# EasyEDA Pro project ProPrj_RGB Controller_2025-11-02.epro

# Schematic Flare Schematic
Board Name: Flare; Create Date: 2025-03-25; Page Name: P1; Project Name: RGB Controller; Schematic Name: Flare Schematic; Update Date: 2025-04-02; Company: folflabs.com; Page Size: A4; Version: V1.0
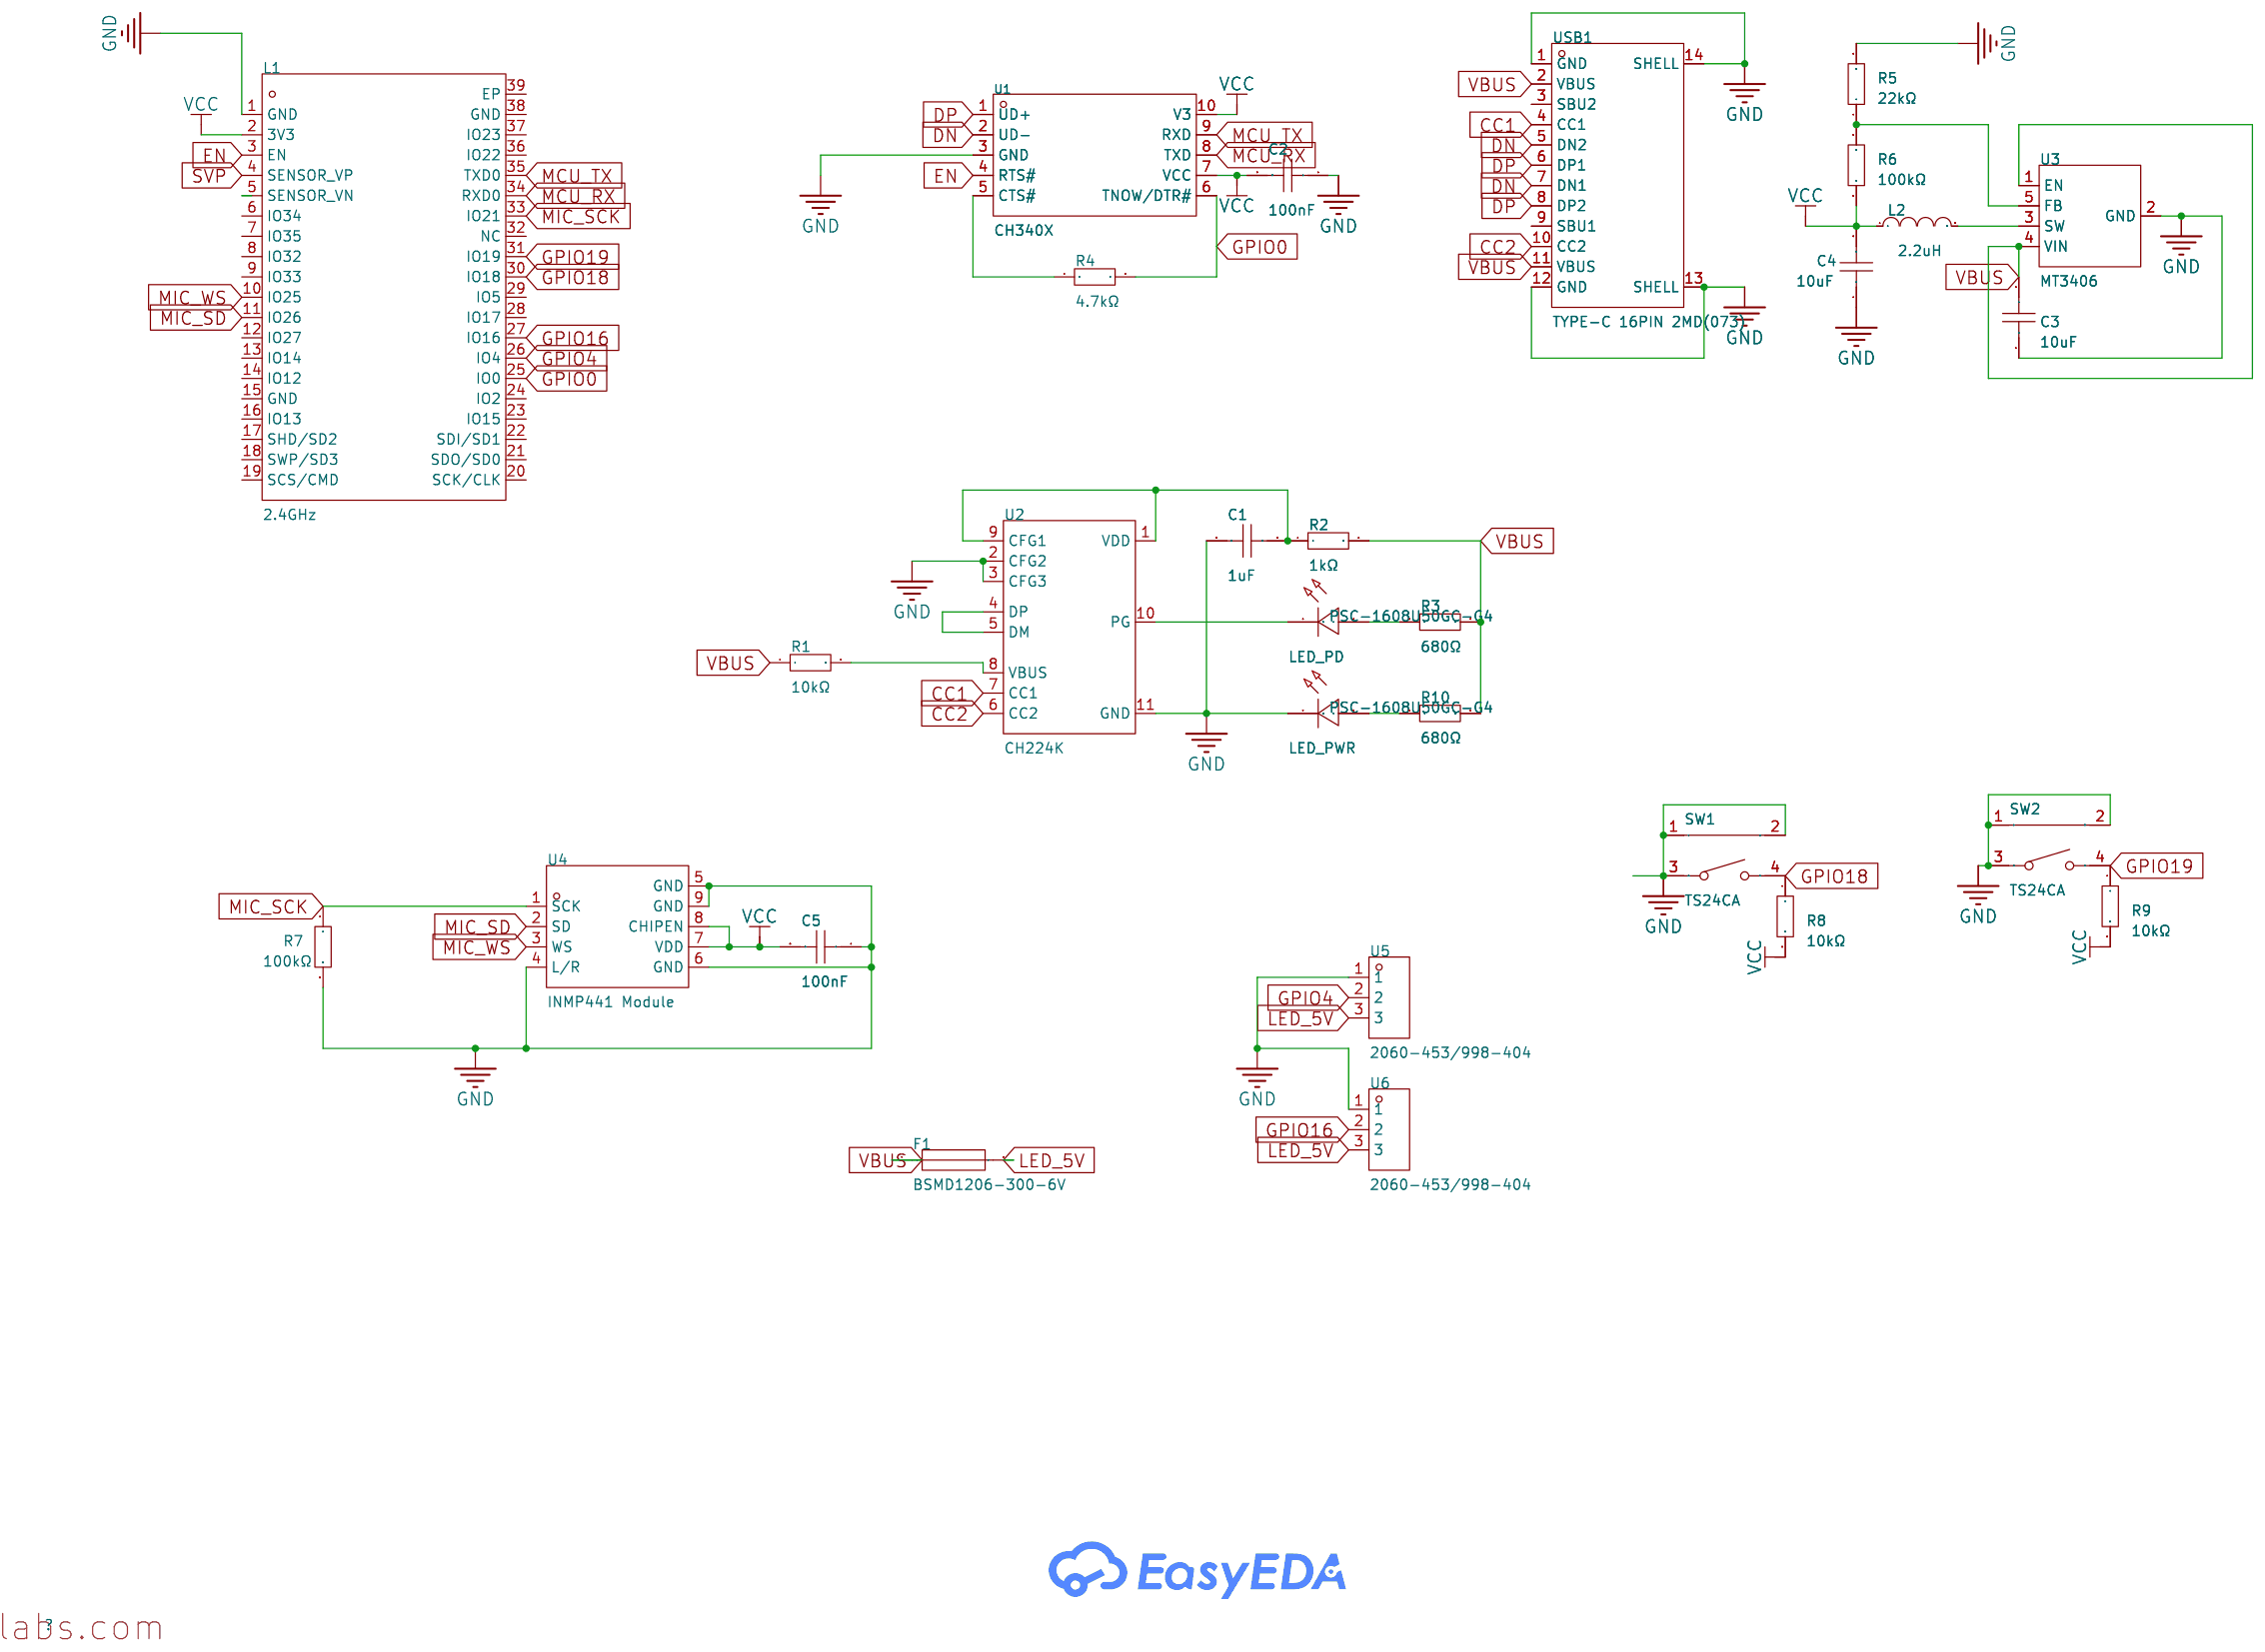
[diagram p0: schematic sheet]

## Parts
C1  1uF  [C0402]
C2  100nF  [C0402]
C3  10uF  [C0603]
C4  10uF  [C0603]
C5  100nF  [C0402]
F1  BSMD1206-300-6V  [F1206]
L1  2.4GHz  [WIFIM-SMD_ESP32-S32MB]
L2  2.2uH  [IND-SMD_L2.5-W2.0_MHCHL2520]
LED_PD  PSC-1608U50GC-G4  [LED0603-RD_GREEN]
LED_PWR  PSC-1608U50GC-G4  [LED0603-RD_GREEN]
R1  10kΩ  [R0402]
R2  1kΩ  [R0402]
R3  680Ω  [R0402]
R4  4.7kΩ  [R0402]
R5  22kΩ  [R0402]
R6  100kΩ  [R0402]
R7  100kΩ  [R0402]
R8  10kΩ  [R0402]
R9  10kΩ  [R0402]
R10  680Ω  [R0402]
SW1  TS24CA  [SW-SMD_TS24CA]
SW2  TS24CA  [SW-SMD_TS24CA]
U1  CH340X  [MSOP-10_L3.0-W3.0-P0.50-LS5.0-BL]
U2  CH224K  [ESSOP-10_L4.9-W3.9-P1.0-LS6.0-TL-EP]
U3  MT3406  [SOT-23-5_L2.9-W1.6-P0.95-LS2.8-BR]
U4  INMP441 Module  [MID-SMD_L4.7-W3.8_INMP441ACEZ]
U5  2060-453/998-404  [CONN-SMD_2060-453]
U6  2060-453/998-404  [CONN-SMD_2060-453]
USB1  TYPE-C 16PIN 2MD(073)  [USB-C-SMD_TYPE-C-6PIN-2MD-073]

## Library data of the parts
C1 = CL05A105KO5NNNC: Capacitance: Tolerance:±10% Tolerance:±10% Voltage Rated: Temperature Coefficient:; LCSC Part Name: 1uF ±10% 16V; Supplier Part: C29266; Manufacturer: SAMSUNG(三星); Supplier Footprint: 0402; JLCPCB Part Class: Extended Part; Datasheet: https://atta.szlcsc.com/upload/public/pdf/source/20160218/1457707763339.pdf; Supplier: LCSC; Tolerance: ±10%
C2 C5 = CL05B104KO5NNNC: Capacitance: Tolerance:±10% Tolerance:±10% Voltage Rated: Temperature Coefficient:; LCSC Part Name: 100nF ±10% 16V; Supplier Part: C1525; Manufacturer: SAMSUNG(三星); Supplier Footprint: 0402; JLCPCB Part Class: Basic Part; Datasheet: https://atta.szlcsc.com/upload/public/pdf/source/20160218/1457707763339.pdf; Supplier: LCSC; Tolerance: ±10%
C3 C4 = CL10A106KP8NNNC: Capacitance: Tolerance:±10% Tolerance:±10% Voltage Rated: Temperature Coefficient:; LCSC Part Name: 10uF ±10% 10V; Supplier Part: C19702; Manufacturer: SAMSUNG(三星); Supplier Footprint: 0603; JLCPCB Part Class: Basic Part; Datasheet: https://atta.szlcsc.com/upload/public/pdf/source/20160218/1457707763339.pdf; Supplier: LCSC; Tolerance: ±10%
F1 = BSMD1206-300-6V: Voltage - Max:6V Current - Max:100A Hold Current:3A Trip Current:6A Power Dissipation:1W Resistance - Initial (Ri) (Min):10mΩ Resistance - Post Trip (R1) (Max):50mΩ Time to Trip(Max):4s Operating Temperature:-40℃~+85℃ Operating Temperature:-40℃~+85℃; LCSC Part Name: 6V 3A 1206自恢复; Supplier Part: C883136; Manufacturer: BHFUSE(佰宏); Supplier Footprint: 1206; JLCPCB Part Class: Extended Part; Datasheet: https://atta.szlcsc.com/upload/public/pdf/source/20250212/FB96FB30E33193B14368CE94976BC83E.pdf; Supplier: LCSC; Voltage - Max: 6V; Current - Max: 100A; Hold Current: 3A; Trip Current: 6A; Power Dissipation: 1W; Resistance - Initial (Ri) (Min): 10mΩ; Resistance - Post Trip (R1) (Max): 50mΩ; Time to Trip(Max): 4s; Operating Temperature: -40℃~+85℃
L1 = ESP32-S32Mb: Core Processor:ESP32芯片 Wireless Standard:- Support Interface:I2C；IR；UART；DAC；SPI；PWM；SDIO；ADC；I2S Frequency:2.4GHz Antenna Type:板载PCBAntenna Output Power:17dBm Output Power:17dBm Operating Voltage:3.3V Operating Voltage:3.3V Receive  Current:- Send  Curre; LCSC Part Name: WiFi模块 ESP32-S 32Mbit; Supplier Part: C2764096; Manufacturer: Ai-Thinker(安信可); JLCPCB Part Class: Extended Part; Datasheet: https://atta.szlcsc.com/upload/public/pdf/source/20210401/C2764096_2F6DB23B9416428872DCC3F2F513F525.pdf; Supplier: LCSC; Core Processor: ESP32芯片; Support Interface: I2C；IR；UART；DAC；SPI；PWM；SDIO；ADC；I2S; Antenna Type: 板载PCBAntenna; Output Power: 17dBm; Operating Voltage: 3.3V; Sensitivity: -90dBm; Operating Temperature: -20℃~+85℃
L2 = FTC252012S2R2MBCA: Inductance: Tolerance:±20% Tolerance:±20% Rated Current:3A Saturation Current (Isat):3.8A DC Resistance (DCR): Type:一体成型电感; LCSC Part Name: 2.2uH ±20% 3.8A; Supplier Part: C5832372; Manufacturer: cjiang(长江微电); Supplier Footprint: 1008; JLCPCB Part Class: Extended Part; Datasheet: https://atta.szlcsc.com/upload/public/pdf/source/20230602/8FFEDA9C0247A92A0D4B67554BFE4091.pdf; Supplier: LCSC; Tolerance: ±20%; Rated Current: 3A; Saturation Current (Isat): 3.8A; Type: 一体成型电感
LED_PD LED_PWR = PSC-1608U50GC-G4: Emitted Color:Green; LCSC Part Name: 钻孔1608高亮绿灯; Supplier Part: C22371298; Manufacturer: HONGLITRONIC(鸿利光电); Supplier Footprint: 0603; JLCPCB Part Class: Extended Part; Datasheet: https://atta.szlcsc.com/upload/public/pdf/source/20240328/1E8DD16A94D1B62ECE930CA637B2D3DA.pdf; Supplier: LCSC; Emitted Color: Green
R1 R8 R9 = 0402WGF1002TCE: Type:Thick Film Resistors Resistance:10kΩ Tolerance:±1% Tolerance:±1% Power(Watts): Overload Voltage (Max): Temperature Coefficient:±100ppm/℃ Temperature Coefficient:±100ppm/℃ Operating Temperature Range:-55℃~+155℃ Operating Temperature Range:-55℃~+155℃; LCSC Part Name: 10kΩ ±1% 62.5mW 厚膜电阻; Supplier Part: C25744; Manufacturer: UNI-ROYAL(厚声); Supplier Footprint: 0402; JLCPCB Part Class: Basic Part; Datasheet: https://atta.szlcsc.com/upload/public/pdf/source/20200306/C422600_1E6D84923E4A46A82E41ADD87F860B5C.pdf; Supplier: LCSC; Type: Thick Film Resistors; Tolerance: ±1%; Temperature Coefficient: ±100ppm/℃; Operating Temperature Range: -55℃~+155℃
R2 = 0402WGF1001TCE: Type:Thick Film Resistors Resistance:1kΩ Tolerance:±1% Tolerance:±1% Power(Watts): Overload Voltage (Max): Temperature Coefficient:±100ppm/℃ Temperature Coefficient:±100ppm/℃ Operating Temperature Range:-55℃~+155℃ Operating Temperature Range:-55℃~+155℃; LCSC Part Name: 1kΩ ±1% 62.5mW 厚膜电阻; Supplier Part: C11702; Manufacturer: UNI-ROYAL(厚声); Supplier Footprint: 0402; JLCPCB Part Class: Basic Part; Datasheet: https://atta.szlcsc.com/upload/public/pdf/source/20200306/C422600_1E6D84923E4A46A82E41ADD87F860B5C.pdf; Supplier: LCSC; Type: Thick Film Resistors; Tolerance: ±1%; Temperature Coefficient: ±100ppm/℃; Operating Temperature Range: -55℃~+155℃
R3 R10 = 0402WGF6800TCE: Type:Thick Film Resistors Resistance: Tolerance:±1% Tolerance:±1% Power(Watts): Overload Voltage (Max): Temperature Coefficient:±100ppm/℃ Temperature Coefficient:±100ppm/℃ Operating Temperature Range:-55℃~+155℃ Operating Temperature Range:-55℃~+155℃; LCSC Part Name: 680Ω ±1% 62.5mW 厚膜电阻; Supplier Part: C25130; Manufacturer: UNI-ROYAL(厚声); Supplier Footprint: 0402; JLCPCB Part Class: Extended Part; Datasheet: https://atta.szlcsc.com/upload/public/pdf/source/20200306/C422600_1E6D84923E4A46A82E41ADD87F860B5C.pdf; Supplier: LCSC; Type: Thick Film Resistors; Tolerance: ±1%; Temperature Coefficient: ±100ppm/℃; Operating Temperature Range: -55℃~+155℃
R4 = 0402WGF4701TCE: Type:Thick Film Resistors Resistance:4.7kΩ Tolerance:±1% Tolerance:±1% Power(Watts): Overload Voltage (Max): Temperature Coefficient:±100ppm/℃ Temperature Coefficient:±100ppm/℃ Operating Temperature Range:-55℃~+155℃ Operating Temperature Range:-55℃~+155℃; LCSC Part Name: 4.7kΩ ±1% 62.5mW 厚膜电阻; Supplier Part: C25900; Manufacturer: UNI-ROYAL(厚声); Supplier Footprint: 0402; JLCPCB Part Class: Basic Part; Datasheet: https://atta.szlcsc.com/upload/public/pdf/source/20200306/C422600_1E6D84923E4A46A82E41ADD87F860B5C.pdf; Supplier: LCSC; Type: Thick Film Resistors; Tolerance: ±1%; Temperature Coefficient: ±100ppm/℃; Operating Temperature Range: -55℃~+155℃
R5 = 0402WGF2202TCE: Type:Thick Film Resistors Resistance:22kΩ Tolerance:±1% Tolerance:±1% Power(Watts): Overload Voltage (Max): Temperature Coefficient:±100ppm/℃ Temperature Coefficient:±100ppm/℃ Operating Temperature Range:-55℃~+155℃ Operating Temperature Range:-55℃~+155℃; LCSC Part Name: 22kΩ ±1% 62.5mW 厚膜电阻; Supplier Part: C25768; Manufacturer: UNI-ROYAL(厚声); Supplier Footprint: 0402; JLCPCB Part Class: Basic Part; Datasheet: https://atta.szlcsc.com/upload/public/pdf/source/20200306/C422600_1E6D84923E4A46A82E41ADD87F860B5C.pdf; Supplier: LCSC; Type: Thick Film Resistors; Tolerance: ±1%; Temperature Coefficient: ±100ppm/℃; Operating Temperature Range: -55℃~+155℃
R6 R7 = 0402WGF1003TCE: Type:Thick Film Resistors Resistance:100kΩ Tolerance:±1% Tolerance:±1% Power(Watts): Overload Voltage (Max): Temperature Coefficient:±100ppm/℃ Temperature Coefficient:±100ppm/℃ Operating Temperature Range:-55℃~+155℃ Operating Temperature Range:-55℃~+155℃; LCSC Part Name: 100kΩ ±1% 62.5mW 厚膜电阻; Supplier Part: C25741; Manufacturer: UNI-ROYAL(厚声); Supplier Footprint: 0402; JLCPCB Part Class: Basic Part; Datasheet: https://atta.szlcsc.com/upload/public/pdf/source/20200306/C422600_1E6D84923E4A46A82E41ADD87F860B5C.pdf; Supplier: LCSC; Type: Thick Film Resistors; Tolerance: ±1%; Temperature Coefficient: ±100ppm/℃; Operating Temperature Range: -55℃~+155℃
SW1 SW2 = TS24CA: Circuit:SPST Actuator Style:Rectangle button Mounting Style:卧贴 Switch Length:4.55mm Switch Width:1.8mm Switch Height:3.5mm Contact Current:50mA Voltage Rating (DC):12V With Lamp:- Mechanical Life:-; LCSC Part Name: 4.55*1.8*3.5mm 卧贴 轻触开关; Supplier Part: C393942; Manufacturer: SHOU HAN(首韩); Supplier Footprint: SMD; Datasheet: https://atta.szlcsc.com/upload/public/pdf/source/20190521/C393942_591A9E318887EFA4274D34029981AD99.pdf; Supplier: LCSC; Circuit: SPST; Actuator Style: Rectangle button; Mounting Style: 卧贴; Switch Length: 4.55mm; Switch Width: 1.8mm; Switch Height: 3.5mm; Contact Current: 50mA; Voltage Rating (DC): 12V
U1 = CH340X: Supplier Part: C3035748; Manufacturer: WCH(南京沁恒); Supplier Footprint: MSOP-10; JLCPCB Part Class: Extended Part; Datasheet: https://atta.szlcsc.com/upload/public/pdf/source/20230530/6E401E9554E9F5311886CC8B3F89B62E.pdf; Supplier: LCSC
U2 = CH224K: LCSC Part Name: USBPD等多快充协议受电芯片CH224; Supplier Part: C970725; Manufacturer: WCH(南京沁恒); Supplier Footprint: ESSOP-10-150mil-1mm; JLCPCB Part Class: Extended Part; Datasheet: https://atta.szlcsc.com/upload/public/pdf/source/20240313/43C2AFDDBDD1F65B60386D2CCAB0811B.pdf; Supplier: LCSC
U3 = MT3406: Function:Step-down type Output Type:Adjustable Voltage - Supply:2V~6V Voltage - Supply:2V~6V Output Voltage:600mV~6V Output Voltage:600mV~6V Output Current:1A Frequency - Switching:1.5MHz Frequency - Switching:1.5MHz Operating Temperature:-40℃~+85℃ Operat; LCSC Part Name: 1A，2V-6V输入，1.5MHz同步降压转换器; Supplier Part: C22462728; Manufacturer: 西安航天民芯; Supplier Footprint: SOT-23-5; JLCPCB Part Class: Extended Part; Datasheet: https://atta.szlcsc.com/upload/public/pdf/source/20240607/11CF4F05DFC4AC07D3B1C3A6F13BBD74.pdf; Supplier: LCSC; Function: Step-down type; Output Type: Adjustable; Voltage - Supply: 2V~6V; Output Voltage: 600mV~6V; Output Current: 1A; Frequency - Switching: 1.5MHz; Operating Temperature: -40℃~+85℃; Synchronous Rectifier: Yes; Number of Outputs: 1; Topology: Step-down; Quiescent Current: 10uA; Switch tube (built-in/external): Built-in
U4 = INMP441 Module: Supplier Part: C9900169261; Supplier Footprint: LGA-9; JLCPCB Part Class: Extended Part; Supplier: LCSC
U5 U6 = 2060-453/998-404: Structure:1x3P Pitch:4mm Color:White Mounting Style:- Number of Pins:3P Number of PINs Per Row:3 Number of Rows:1 Current Rating (Max):9A Voltage Rating (Max):320V Wire Gauge - AWG:18~24 Wire Gauge - mm2:- Operating Temperature Range:-60℃~+105℃ Operating; LCSC Part Name: 1x3P 4mm 每排P数:3 排数:1; Supplier Part: C2765056; Manufacturer: WAGO(万可); Supplier Footprint: SMD,P=4mm; JLCPCB Part Class: Extended Part; Datasheet: https://atta.szlcsc.com/upload/public/pdf/source/20210406/C2765056_9CDA2223E0E8215FA599894D0B3F06B8.pdf; Supplier: LCSC; Structure: 1x3P; Pitch: 4mm; Color: White; Number of Pins: 3P; Number of PINs Per Row: 3; Number of Rows: 1; Current Rating (Max): 9A; Voltage Rating (Max): 320V; Wire Gauge - AWG: 18~24; Operating Temperature Range: -60℃~+105℃
USB1 = TYPE-C 16PIN 2MD(073): Connector Type:Type-C Standard:USB 3.1 Gender:Female Mounting Style:Horizontal attachment Number of Contacts:16P Number of Ports:1 Current Rating - Power (Max):5A Operating Temperature Range:-25℃~+85℃ Operating Temperature Range:-25℃~+85℃ Rated Voltage (M; LCSC Part Name: Type-C 母 卧贴; Supplier Part: C2765186; Manufacturer: SHOU HAN(首韩); Supplier Footprint: SMD; Datasheet: https://atta.szlcsc.com/upload/public/pdf/source/20211123/39B17C16241EAC15C5E277BDA434118E.pdf; Supplier: LCSC; Connector Type: Type-C; Standard: USB 3.1; Gender: Female; Mounting Style: Horizontal attachment; Number of Contacts: 16P; Number of Ports: 1; Current Rating - Power (Max): 5A; Operating Temperature Range: -25℃~+85℃; Rated Voltage (Max): 5V; Connect-Disconnect Life: 5000 Cuts; Core Colour: Black

## Nets
GND: C1.2 C2.1 C3.1 C4.1 C5.1 L1.1(GND) LED_PWR.1(C) R5.2 R7.2 SW1.1 SW1.2 SW1.3 SW2.1 SW2.2 SW2.3 U1.3(GND) U2.2(CFG2) U2.3(CFG3) U2.11(GND) U3.2(GND) U4.4(L/R) U4.5(GND) U4.6(GND) U4.9(GND) U5.1 U6.1 USB1.1(GND) USB1.12(GND) USB1.13(SHELL) USB1.14(SHELL)
VBUS: C3.2 F1.1 R1.1 R2.2 R3.2 R10.2 U3.1(EN) U3.4(VIN) USB1.2(VBUS) USB1.11(VBUS)
VCC: C2.2 C4.2 C5.2 L1.2(3V3) L2.1 R6.2 R8.2 R9.2 U1.7(VCC) U1.10(V3) U4.7(VDD) U4.8(CHIPEN)
CC1: U2.7(CC1) USB1.4(CC1)
CC2: U2.6(CC2) USB1.10(CC2)
DN: U1.2(UD-) USB1.5(DN2) USB1.7(DN1)
DP: U1.1(UD+) USB1.6(DP1) USB1.8(DP2)
EN: L1.3(EN) U1.4(RTS#)
GPIO0: L1.25(IO0) R4.2 U1.6(TNOW/DTR#)
GPIO4: L1.26(IO4) U5.2
GPIO16: L1.27(IO16) U6.2
GPIO18: L1.30(IO18) R8.1 SW1.4
GPIO19: L1.31(IO19) R9.1 SW2.4
LED_5V: F1.2 U5.3 U6.3
MCU_RX: L1.34(RXD0) U1.8(TXD)
MCU_TX: L1.35(TXD0) U1.9(RXD)
MIC_SCK: L1.33(IO21) R7.1 U4.1(SCK)
MIC_SD: L1.11(IO26) U4.2(SD)
MIC_WS: L1.10(IO25) U4.3(WS)
SVP: L1.4(SENSOR_VP)
$1N2065: LED_PD.2(A) R3.1
$1N2819: R5.1 R6.1 U3.5(FB)
$1N5758: LED_PWR.2(A) R10.1
Net-(C1-1): C1.1 R2.1 U2.1(VDD) U2.9(CFG1)
Net-(L2-2): L2.2 U3.3(SW)
Net-(LED_PD-1): LED_PD.1(C) U2.10(PG)
Net-(R1-2): R1.2 U2.8(VBUS)
Net-(R4-1): R4.1 U1.5(CTS#)
Net-(U2-4): U2.4(DP) U2.5(DM)

Not connected (* = marked no-connect by the designer): L1 5(SENSOR_VN) 6(IO34) 7(IO35) 8(IO32) 9(IO33) 12(IO27) 13(IO14) 14(IO12) 15(GND) 16(IO13) 17(SHD/SD2) 18(SWP/SD3) 19(SCS/CMD) 20(SCK/CLK) 21(SDO/SD0) 22(SDI/SD1) 23(IO15) 24(IO2) 28(IO17) 29(IO5) 32(NC) 36(IO22) 37(IO23) 38(GND) 39(EP); USB1 3(SBU2) 9(SBU1)

# Board Flare PCB
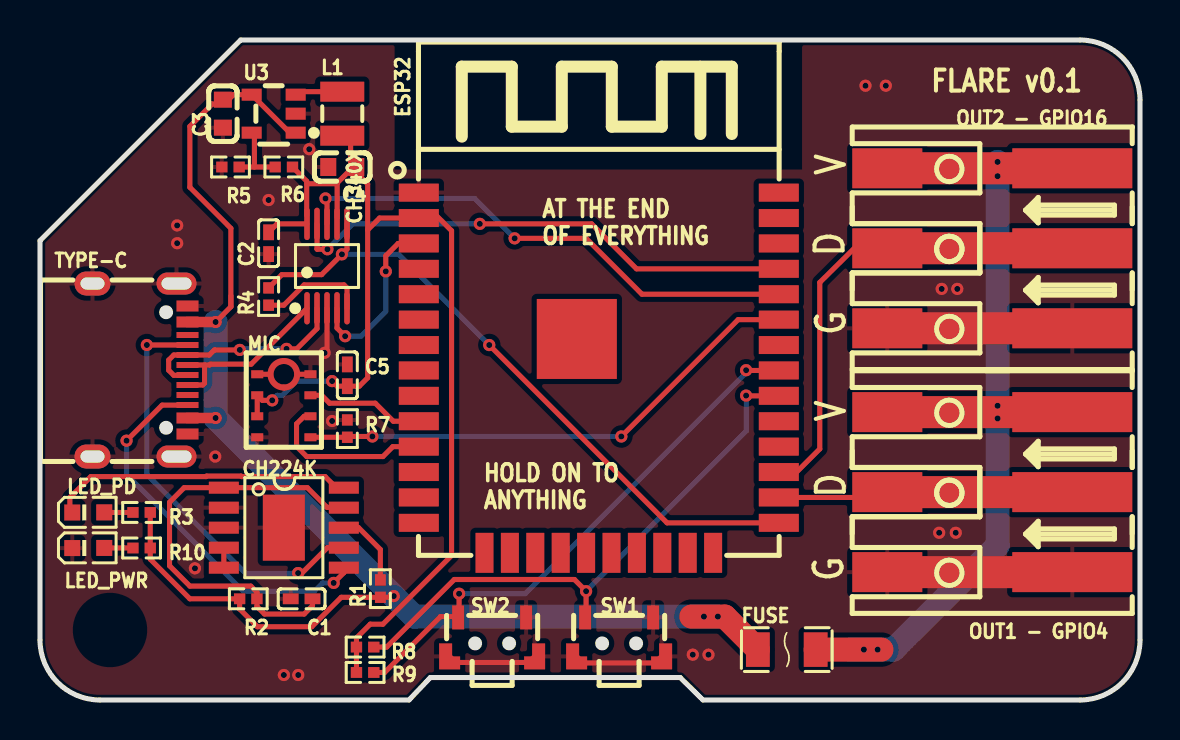
[diagram p1: board, top side]
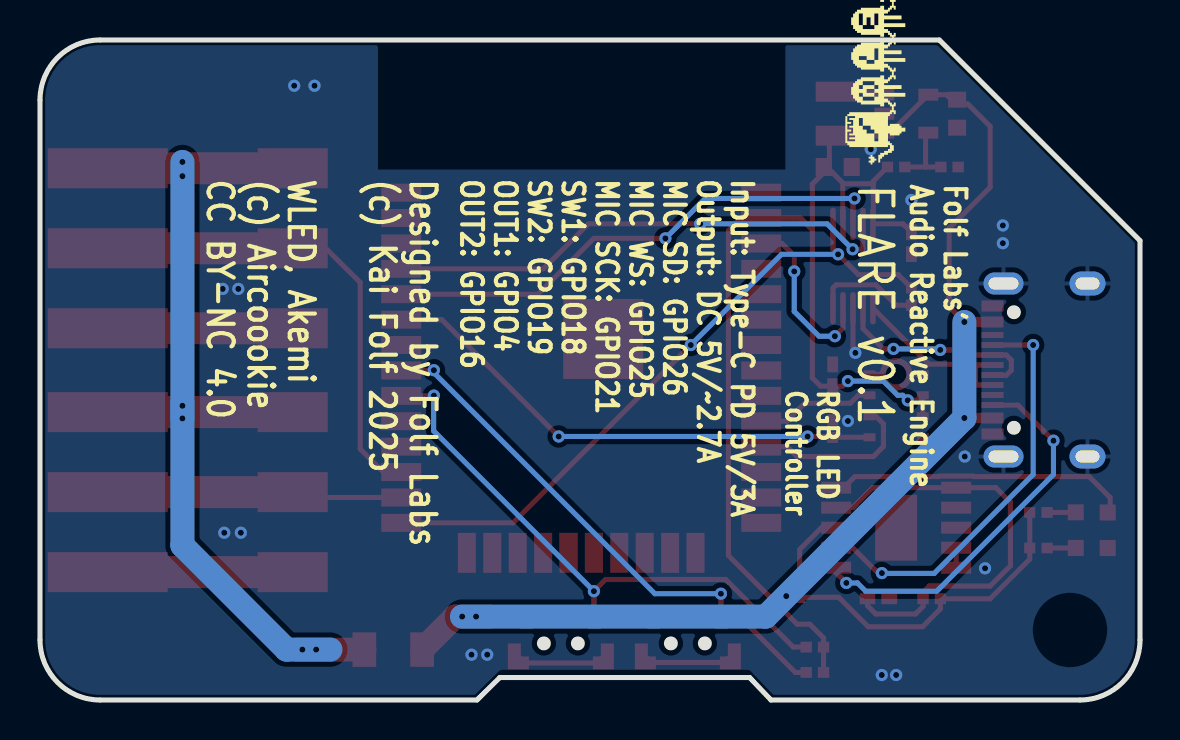
[diagram p2: board, bottom side, seen from below]

Outline 55 x 33 mm; copper layers: Top Layer, Bottom Layer. Coordinates in mm from the lower left corner of the outline.
Outline path: 0,22.97 0,3 arc(0.88,0.88) 3,0 18.45,0 19.52,1.12 32.01,1.12 33.15,0 52,0 arc(54.12,0.88) 55,3 55,30 arc(54.12,32.12) 52,33 10.03,33 0,22.97
Stack: Top Layer 0.035mm / Dielectric1 1.51mm FR4 er 4.5 / Bottom Layer 0.035mm

## Design rules (mm)
template: Custom Config
spacing copperThickness1oz (default): track to track 0.102, other pairs 0.152 to 0.3
spacing copperThickness2oz: track to track 0.203, other pairs 0.152 to 0.3
track width copperThickness1oz (default): min 0.127, default 0.254, max 2.54
track width copperThickness2oz: min 0.203, default 0.254, max 2.54
differential pair differentialPair (default): width min 0.127, default 0.254, max 2.54; gap min 0.152, default 0.152
via viaSize (default): diameter min 0.5, default 0.61, max 10; hole min 0.3, default 0.305, max 6.3

## Placement (name value [footprint] x y rotation side)
C1  1uF  [C0402]  13.08 5.06 180 top
C2  100nF  [C0402]  11.43 22.84 90 top
C3  10uF  [C0603]  9.14 29.32 90 top
C4  10uF  [C0603]  15.11 26.65 0 top
C5  100nF  [C0402]  15.37 16.24 270 top
CH224K  CH224K  [ESSOP-10_L4.9-W3.9-P1.0-LS6.0-TL-EP]  12.19 8.62 270 top
CH340X  CH340X  [MSOP-10_L3.0-W3.0-P0.50-LS5.0-BL]  14.35 21.7 0 top
ESP32  2.4GHz  [WIFIM-SMD_ESP32-S32MB]  27.94 16.36 0 top
FUSE  BSMD1206-300-6V  [F1206]  37.34 2.52 0 top
L1  2.4GHz  [IND-SMD_L2.5-W2.0_MHCHL2520]  15.11 29.32 90 top
LED_PD  PSC-1608U50GC-G4  [LED0603-RD_GREEN]  2.41 9.38 0 top
LED_PWR  PSC-1608U50GC-G4  [LED0603-RD_GREEN]  2.41 7.6 0 top
MIC  INMP441 Module  [MID-SMD_L4.7-W3.8_INMP441ACEZ]  12.19 14.71 90 top
OUT1 - GPIO4  2060-453/998-404  [CONN-SMD_2060-453]  46.99 10.39 180 top
OUT2 - GPIO16  2060-453/998-404  [CONN-SMD_2060-453]  46.99 22.59 180 top
R1  10kΩ  [R0402]  17.02 5.57 90 top
R2  1kΩ  [R0402]  10.41 5.06 180 top
R3  680Ω  [R0402]  5.08 9.38 0 top
R4  4.7kΩ  [R0402]  11.43 20.17 90 top
R5  22kΩ  [R0402]  9.53 26.65 180 top
R6  100kΩ  [R0402]  12.19 26.65 0 top
R7  100kΩ  [R0402]  15.37 13.57 90 top
R8  10kΩ  [R0402]  16.26 2.65 180 top
R9  10kΩ  [R0402]  16.26 1.38 180 top
R10  680Ω  [R0402]  5.08 7.6 0 top
SW1  TS24CA  [SW-SMD_TS24CA]  28.96 3.16 180 top
SW2  TS24CA  [SW-SMD_TS24CA]  22.61 3.16 180 top
TYPE-C  TYPE-C 16PIN 2MD(073)  [USB-C-SMD_TYPE-C-6PIN-2MD-073]  5 16.5 270 top
U3  MT3406  [SOT-23-5_L2.9-W1.6-P0.95-LS2.8-BR]  11.68 29.32 0 top

## Footprints (pads in the part's own frame, mm; a bottom-side part is the same pattern mirrored in y, then rotated)
C0402
  rect 0.79x0.54 smd: 1(-0.545,0) 2(0.545,0)
C0603
  rect 0.8x0.9 smd: 1(-0.7,0) 2(0.7,0)
CONN-SMD_2060-453
  rect 6x2 smd: 1(-4.625,4) 2(-4.625,0) 3(-4.625,-4)
  rect 3.5x2 smd: 1(4.625,4) 2(4.625,0) 3(4.625,-4)
ESSOP-10_L4.9-W3.9-P1.0-LS6.0-TL-EP
  rect 0.6x1.5 smd: 1(-2,-3) 2(-1,-3) 3(0,-3) 4(1,-3) 5(2,-3) 6(2,3) 7(1,3) 8(0,3) 9(-1,3) 10(-2,3)
  rect 3.3x2.1 smd: 11(0,0)
F1206
  rect 1.19x1.728 smd: 1(-1.445,0) 2(1.445,0)
IND-SMD_L2.5-W2.0_MHCHL2520
  rect 1x2.2 smd: 1(-1.1,0) 2(1.1,0)
LED0603-RD_GREEN
  rect 0.8x0.8 smd: 1(-0.799,-0.004) 2(0.799,0.004)
MID-SMD_L4.7-W3.8_INMP441ACEZ
  rect 0.4x0.6 smd: 1(-1.575,-1.33) 2(-0.525,-1.33) 3(0.525,-1.33) 4(1.575,-1.33) 6(1.575,1.33) 7(0.525,1.33) 8(-0.525,1.33) 9(-1.575,1.33)
  custom 1.626x0.963 smd: 5(1.575,0.664)
  custom 1.626x0.966 smd: 5(1.575,-0.661)
MSOP-10_L3.0-W3.0-P0.50-LS5.0-BL
  oval 0.28x1.62 smd: 1(-1,-2.11) 2(-0.5,-2.11) 3(0,-2.11) 4(0.5,-2.11) 5(1,-2.11) 6(1,2.11) 7(0.5,2.11) 8(0,2.11) 9(-0.5,2.11) 10(-1,2.11)
R0402
  rect 0.566x0.54 smd: 1(-0.433,0) 2(0.433,0)
SOT-23-5_L2.9-W1.6-P0.95-LS2.8-BR
  rect 1x0.6 smd: 1(1.1,-0.95) 2(1.1,0) 3(1.1,0.95) 4(-1.1,0.95) 5(-1.1,-0.95)
SW-SMD_TS24CA
  custom 1.05x1.3 smd: 1(-2.125,0.975) 2(2.125,0.975)
  rect 0.6x1.2 smd: 3(-1.7,-0.975) 4(1.7,-0.975)
USB-C-SMD_TYPE-C-6PIN-2MD-073
  rect 0.55x1.1 smd: 1(-3.2,2.375) 2(-2.4,2.375) 11(2.4,2.375) 12(3.2,2.375)
  rect 0.3x1.1 smd: 3(-1.75,2.375) 4(-1.25,2.375) 5(-0.75,2.375) 6(-0.25,2.375) 7(0.25,2.375) 8(0.75,2.375) 9(1.25,2.375) 10(1.75,2.375)
  oval 1.1x2 hole 0.6x1.5: 13(-4.325,1.825) 14(4.325,1.825)
  oval 1.2x1.8 hole 0.6x1.2: 13(-4.325,-2.375) 14(4.325,-2.375)
WIFIM-SMD_ESP32-S32MB
  rect 2x0.9 smd: 1(-9,9.005) 2(-9,7.735) 3(-9,6.465) 4(-9,5.195) 5(-9,3.925) 6(-9,2.655) 7(-9,1.385) 8(-9,0.115) 9(-9,-1.155) 10(-9,-2.425) 11(-9,-3.695) 12(-9,-4.965) 13(-9,-6.235) 14(-9,-7.505) 25(9,-7.505) 26(9,-6.235) 27(9,-4.965) 28(9,-3.695) 29(9,-2.425) 30(9,-1.155) 31(9,0.115) 32(9,1.385) 33(9,2.655) 34(9,3.925) 35(9,5.195) 36(9,6.465) 37(9,7.735) 38(9,9.005)
  rect 0.9x2 smd: 15(-5.715,-9.005) 16(-4.445,-9.005) 17(-3.175,-9.005) 18(-1.905,-9.005) 19(-0.635,-9.005) 20(0.635,-9.005) 21(1.905,-9.005) 22(3.175,-9.005) 23(4.445,-9.005) 24(5.715,-9.005)
  rect 4x4 smd: 39(-1.1,1.689)

## Nets
GND: C1.2 C2.1 C3.1 C4.1 C5.1 CH224K.2 CH224K.3 CH224K.11 CH340X.3 ESP32.1 LED_PWR.1 MIC.4 MIC.5 MIC.6 MIC.9 OUT1 - GPIO4.1 OUT2 - GPIO16.1 R5.2 R7.2 SW1.1 SW1.2 SW1.3 SW2.1 SW2.2 SW2.3 TYPE-C.1 TYPE-C.12 TYPE-C.13 TYPE-C.14 U3.2
VBUS: C3.2 FUSE.1 R1.1 R2.2 R3.2 R10.2 TYPE-C.2 TYPE-C.11 U3.1 U3.4
VCC: C2.2 C4.2 C5.2 CH340X.7 CH340X.10 ESP32.2 L1.1 MIC.7 MIC.8 R6.2 R8.2 R9.2
CC1: CH224K.7 TYPE-C.4
CC2: CH224K.6 TYPE-C.10
DN: CH340X.2 TYPE-C.5 TYPE-C.7
DP: CH340X.1 TYPE-C.6 TYPE-C.8
EN: CH340X.4 ESP32.3
GPIO0: CH340X.6 ESP32.25 R4.2
GPIO4: ESP32.26 OUT1 - GPIO4.2
GPIO16: ESP32.27 OUT2 - GPIO16.2
GPIO18: ESP32.30 R8.1 SW1.4
GPIO19: ESP32.31 R9.1 SW2.4
LED_5V: FUSE.2 OUT1 - GPIO4.3 OUT2 - GPIO16.3
MCU_RX: CH340X.8 ESP32.34
MCU_TX: CH340X.9 ESP32.35
MIC_SCK: ESP32.33 MIC.1 R7.1
MIC_SD: ESP32.11 MIC.2
MIC_WS: ESP32.10 MIC.3
SVP: ESP32.4
$1N387: ESP32.5
$1N1555: CH224K.8 R1.2
$1N1786: CH224K.10 LED_PD.1
$1N1849: CH224K.4 CH224K.5
$1N2043: C1.1 CH224K.1 CH224K.9 R2.1
$1N2065: LED_PD.2 R3.1
$1N2118: CH340X.5 R4.1
$1N2569: L1.2 U3.3
$1N2819: R5.1 R6.1 U3.5
$1N5758: LED_PWR.2 R10.1

Pads without a net: ESP32 6 7 8 9 12 13 14 15 16 17 18 19 20 21 22 23 24 28 29 32 36 37 38 39; TYPE-C 3 9

## Via types
v1: diameter 0.61, hole 0.305, Top Layer to Bottom Layer, 51 vias

## Routing (per net, layer and track width the routed paths; a pad name or vN(x,y) marks a point on that pad's centre or on a via; arc(x,y) is an arc through that point)
GND: length 31.1
  Top Layer w0.254: SW2.1 24.43,1.88 20.79,1.88 SW2.2 ; v1(14.23,17.36) 14.35,17.48 CH340X.3 ; MIC.5 MIC.4 ; SW1.1 30.75,1.85 27.16,1.85 SW1.2 ; MIC.6 MIC.5
  Top Layer w1.6: OUT2 - GPIO16.1 OUT2 - GPIO16.1 ; OUT1 - GPIO4.1 OUT1 - GPIO4.1
  vias: v1(6.86,23.73) v1(6.86,22.84) v1(7.75,6.58) v1(8.76,12.17) v1(11.43,25) v1(12.19,1.25) v1(12.91,1.25) v1(13.46,27.54) v1(14.6,13.95) v1(32.64,2.27) v1(33.42,2.27) v1(41.28,30.71) v1(42.29,30.71) v1(44.96,8.36) v1(45.09,20.55) v1(45.79,8.36) v1(45.87,20.55)
VBUS: length 75.9
  Top Layer w0.254: v1(8.78,18.9) 9.54,19.66 ; 9.54,19.66 9.54,23.58 7.49,25.63 7.49,28.68 8.61,29.8 9.27,29.8 ; 9.54,19.66 9.54,20.21 ; 9.27,29.86 9.68,30.27 U3.4 12.48,28.37 12.78,28.37 ; v1(17.69,5.19) 17.63,5.14 15.06,5.14 13.59,3.66 10.87,3.66 9.98,4.55 R2.2 7.49,5.06 5.51,7.04 R10.2 R3.2
  Top Layer w0.52: TYPE-C.2 v1(8.78,18.9) ; TYPE-C.11 v1(8.78,14.1)
  Top Layer w1.2: 32.57,4.17 34.24,4.17 FUSE.1
  Bottom Layer w1.2: v1(8.78,18.9) 8.78,14.08 ; v1(8.78,14.1) 18.71,4.17 33.9,4.17
  vias: v1(33.2,4.17) v1(33.89,4.17)
VCC: length 58.1
  Top Layer w0.254: R6.2 13.34,25.94 13.34,24.24 ; 13.34,25.81 14.86,25.81 ; 14.86,24.11 14.86,25.85 15.53,26.52 ; 15.82,1.5 15.82,3.1 16.51,3.79 17.15,3.79 20.58,7.22 20.58,23.46 19.82,24.22 19.07,24.22 ESP32.2 16.98,24.1 16.38,23.5 ; CH340X.10 11.85,23.81 C2.2 ; L1.1 15.53,27.8 15.53,26.65 16.38,25.8 16.38,23.5 ; 16.38,23.5 16.38,16.11 15.97,15.69 C5.2 14.86,15.69 v1(14.6,15.94) ; v1(11.61,14.98) 11.12,14.98 10.86,15.24 MIC.8
  Bottom Layer w0.254: v1(11.61,14.98) 11.87,15.24 12.12,15.24 12.83,15.94 v1(14.6,15.94)
CC1: length 20.9
  Top Layer w0.254: v1(12.91,6.35) 13.1,6.35 14.37,7.62 CH224K.7 ; v1(5.34,17.75) TYPE-C.4
  Bottom Layer w0.254: v1(5.34,17.75) 5.34,11.27 10.29,6.33 12.89,6.33 v1(12.91,6.35)
CC2: length 19.4
  Top Layer w0.254: 7.37,14.74 6.11,14.74 v1(4.33,12.97) ; CH224K.6 15.19,6.36 v1(14.68,5.85)
  Bottom Layer w0.254: v1(14.68,5.85) 14.13,5.85 13.72,5.44 10.16,5.44 4.33,11.27 v1(4.33,12.97)
DN: length 10.6
  Top Layer w0.254: v1(12.33,17.56) 12.84,17.56 13.85,18.57 CH340X.2 ; TYPE-C.7 7.36,16.23 6.69,16.23 6.43,16.49 6.43,17 6.69,17.25 TYPE-C.5 8.47,17.25 8.72,17.5 v1(9.99,17.5)
  Bottom Layer w0.254: v1(9.99,17.5) 10.04,17.56 v1(12.33,17.56)
DP: length 9
  Top Layer w0.254: TYPE-C.8 8.14,15.75 8.23,15.84 8.23,16.75 ; 8.23,16.75 TYPE-C.6 ; 8.23,16.75 8.48,16.75 8.53,16.79 10.56,16.79 CH340X.1
EN: length 8.8
  Top Layer w0.254: v1(15.26,18.19) 14.85,18.6 CH340X.4 ; v1(17.29,21.43) 17.29,22.21 17.91,22.83 ESP32.3
  Bottom Layer w0.254: v1(15.26,18.19) 16.05,18.19 17.29,19.43 v1(17.29,21.43)
GPIO0: length 33.4
  Top Layer w0.254: ESP32.25 31.35,8.86 v1(22.46,17.75) ; CH340X.6 15.35,22.54 v1(15.1,22.28) 14.08,21.27 12.09,21.27 R4.2
  Bottom Layer w0.254: v1(15.1,22.28) 17.93,22.28 v1(22.46,17.75)
GPIO18: length 28.3
  Top Layer w0.254: 27.18,4.17 27.31,4.3 v1(27.31,5.44) 26.72,6.03 20.71,6.03 17.34,2.65 R8.1 ; v1(35.31,15.22) 35.32,15.21 ESP32.30
  Bottom Layer w0.254: 35.32,15.21 35.32,13.45 v1(27.31,5.44)
GPIO19: length 26.9
  Top Layer w0.254: 16.68,1.38 17.23,1.38 20.03,4.17 20.87,4.17 SW2.4 20.96,4.18 v1(20.96,5.31) ; v1(35.31,16.49) 35.32,16.48 ESP32.31
  Bottom Layer w0.254: 21.21,5.31 24.26,5.31 35.31,16.36
LED_5V: length 51.3
  Top Layer w1.2: FUSE.2 42.07,2.52
  Top Layer w1.6: OUT1 - GPIO4.3 OUT1 - GPIO4.3 ; OUT2 - GPIO16.3 OUT2 - GPIO16.3
  Bottom Layer w1.2: 40.48,2.52 42.67,2.52 47.88,7.73 47.88,14.85 ; v1(47.88,26.9) v1(47.88,14.08)
  vias: v1(41.19,2.52) v1(41.88,2.52) v1(47.88,26.19) v1(47.88,14.71)
MCU_RX: length 26
  Top Layer w0.254: CH340X.8 14.35,25 v1(14.28,25.08) ; v1(23.73,23.08) 27.31,23.08 30.1,20.29 ESP32.34
  Bottom Layer w0.254: v1(14.28,25.08) 21.74,25.08 v1(23.73,23.08)
MCU_TX: length 25.8
  Top Layer w0.254: v1(14.37,22.54) 13.86,22.54 13.85,22.55 CH340X.9 ; v1(21.99,23.81) 27.58,23.81 29.83,21.56 ESP32.35
  Bottom Layer w0.254: v1(21.99,23.81) 15.64,23.81 v1(14.37,22.54)
MIC_SCK: length 25.9
  Top Layer w0.254: ESP32.33 34.91,19.02 v1(29.07,13.18) ; v1(16.62,13.18) 15.41,13.18 R7.1 MIC.1
  Bottom Layer w0.254: v1(29.07,13.18) v1(16.62,13.18)
MIC_SD: length 8.5
  Top Layer w0.254: ESP32.11 17.64,12.67 17.15,12.17 13.34,12.17 12.83,12.68 12.83,13.81 13.21,14.19 MIC.2
MIC_WS: length 6
  Top Layer w0.254: 13.52,15.24 14.08,15.24 14.48,14.84 16.76,14.84 17.66,13.94 ESP32.10
$1N1555: length 3.8
  Top Layer w0.254: R1.2 17.02,7.53 15.93,8.62 CH224K.8
$1N1786: length 15.2
  Top Layer w0.254: CH224K.10 14.81,10.62 14.26,11.17 10.08,11.17 10.06,11.19 8.33,11.19 8.3,11.17 2.54,11.17 1.49,10.12 1.49,9.63 1.75,9.38
$1N1849: length 1
  Top Layer w0.254: CH224K.5 CH224K.4
$1N2043: length 21.7
  Top Layer w0.254: C1.1 13.63,4.72 13.21,4.3 11.23,4.3 10.85,4.68 10.85,5.39 10.54,5.69 7.49,5.69 6.48,6.71 6.48,9.89 7.21,10.62 CH224K.1 13.37,10.62 14.35,9.63 15.18,9.63 CH224K.9
$1N2065: length 1.4
  Top Layer w0.254: 4.65,9.38 3.22,9.38 LED_PD.2
$1N2118: length 5.4
  Top Layer w0.254: CH340X.5 15.35,20.6 15.2,20.76 13.21,20.76 12.19,19.74 R4.1
$1N2569: length 2.4
  Top Layer w0.254: U3.3 12.93,30.42 L1.2
$1N2819: length 3.6
  Top Layer w0.254: R5.1 10.72,26.65 ; 10.72,26.65 R6.1 ; 10.72,26.65 10.72,28.23 10.58,28.37
$1N5758: length 1.4
  Top Layer w0.254: 4.65,7.6 4.64,7.6 LED_PWR.2
GPIO4: length 13.9
  Top Layer w0.254: ESP32.26 41.32,10.13
  Top Layer w1.6: OUT1 - GPIO4.2 51.89,10.39
GPIO16: length 21.8
  Top Layer w0.254: 37.72,11.28 38.99,12.55 38.99,20.88 40.71,22.59
  Top Layer w1.6: OUT2 - GPIO16.2 OUT2 - GPIO16.2

## Copper pours and planes (outline as drawn; the poured copper is in the pictures)
GND on Top Layer: -0.51,37.19 58.29,37.19 58.29,-0.66 -0.51,-0.66
GND on Top Layer: -0.38,33.38 55.75,33.38 55.75,-1.54 -0.38,-1.54
GND on Bottom Layer: -1.15,34.02 55.63,34.02 55.63,-0.91 -1.15,-0.91

## Text on the board
Bottom Silkscreen Layer: RGB LED / Controller | Folf Labs' / Audio Reactive Engine | Input: Type-C PD 5V/3A / Output: DC 5V/~2.7A / MIC SD: GPIO26 / MIC WS: GPIO25 / MIC SCK: GPIO21 / SW1: GPIO18 / SW2: GPIO19 / OUT1: GPIO4 / OUT2: GPIO16 | Designed by Folf Labs / (c) Kai Folf 2025 / WLED, Akemi / (c) Aircoookie / CC BY-NC 4.0 | FLARE v0.1
Top Silkscreen Layer: HOLD ON TO / ANYTHING | AT THE END / OF EVERYTHING | FLARE v0.1 | G | D | V
